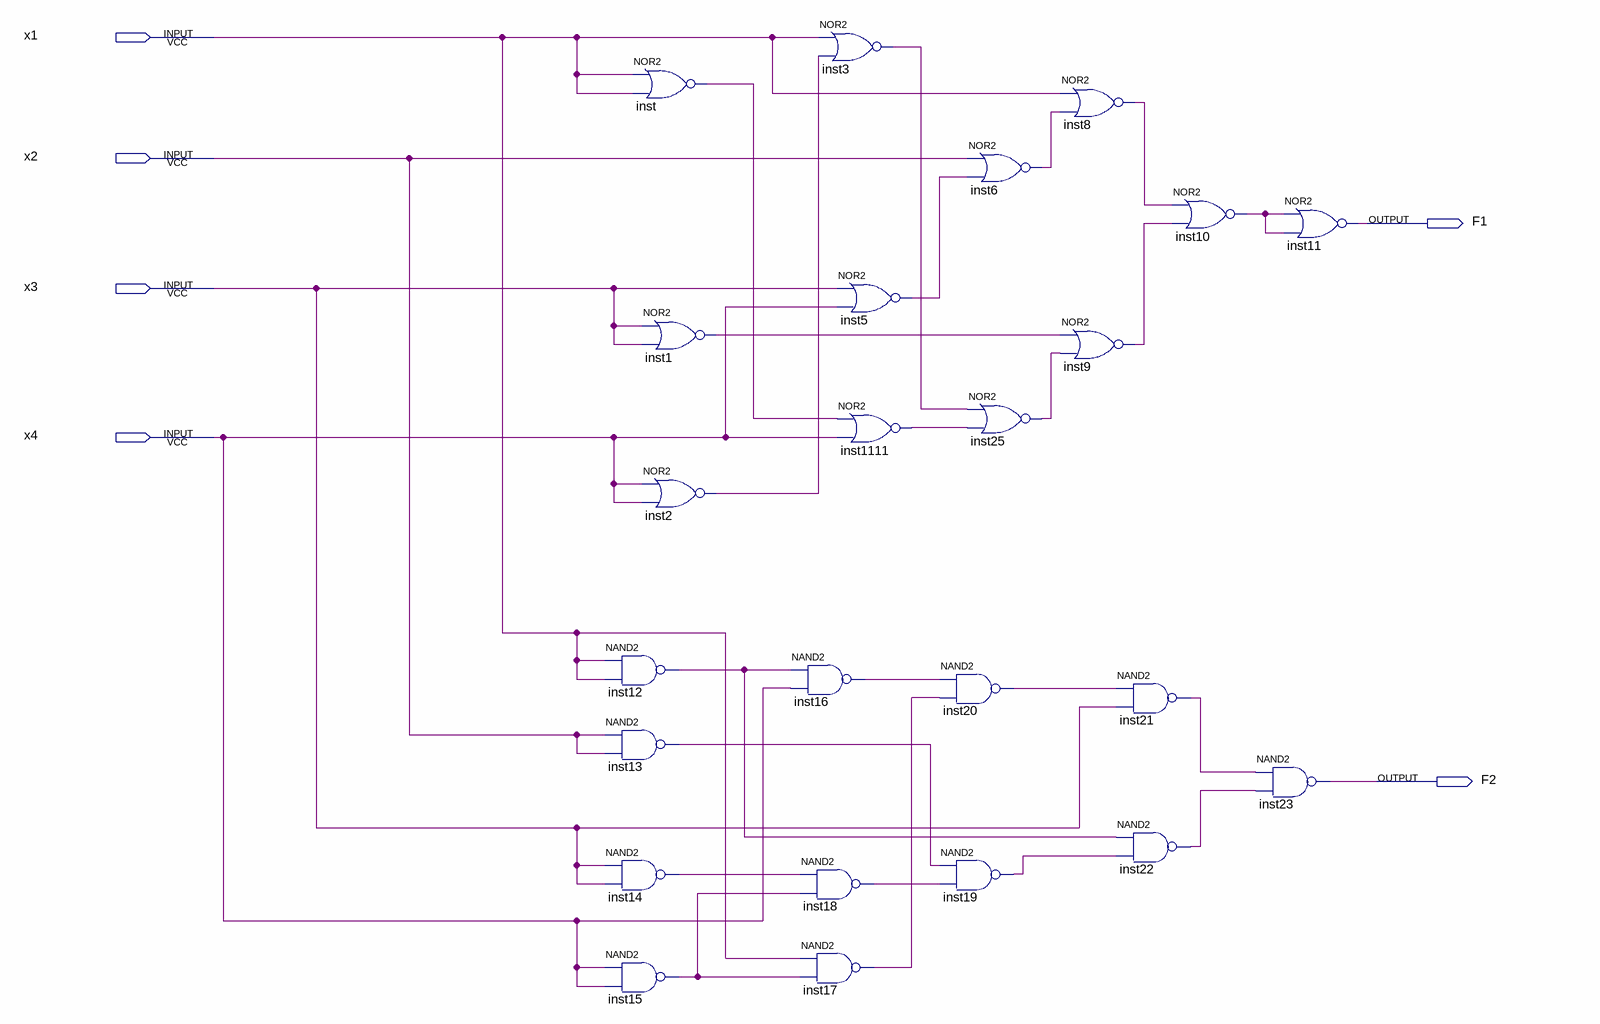
[diagram p0: schematic sheet]
// Quartus schematic lab1.bdf as structural Verilog: 24 symbols, 6 pins
module lab1 (
  input  x1,
  input  x2,
  input  x3,
  input  x4,
  output F1,
  output F2
);

  wire inst1_out, inst2_out, inst3_out, inst5_out, inst6_out, inst8_out, inst9_out, inst10_out, inst12_out,
       inst13_out, inst14_out, inst15_out, inst16_out, inst17_out, inst18_out, inst19_out, inst20_out,
       inst21_out, inst22_out, inst25_out, inst1111_out, inst_out;

  nor inst (inst_out, x1, x1);
  nor inst1 (inst1_out, x3, x3);
  nor inst2 (inst2_out, x4, x4);
  nand inst12 (inst12_out, x1, x1);
  nand inst13 (inst13_out, x2, x2);
  nand inst14 (inst14_out, x3, x3);
  nand inst15 (inst15_out, x4, x4);
  nand inst16 (inst16_out, inst12_out, x4);
  nand inst18 (inst18_out, inst14_out, inst15_out);
  nand inst17 (inst17_out, x1, inst15_out);
  nor inst3 (inst3_out, x1, inst2_out);
  nor inst5 (inst5_out, x3, x4);
  nor inst1111 (inst1111_out, inst_out, x4);
  nand inst20 (inst20_out, inst16_out, inst17_out);
  nand inst19 (inst19_out, inst13_out, inst18_out);
  nor inst6 (inst6_out, x2, inst5_out);
  nor inst25 (inst25_out, inst3_out, inst1111_out);
  nor inst8 (inst8_out, x1, inst6_out);
  nor inst9 (inst9_out, inst1_out, inst25_out);
  nor inst10 (inst10_out, inst8_out, inst9_out);
  nand inst21 (inst21_out, inst20_out, x3);
  nand inst22 (inst22_out, inst12_out, inst19_out);
  nor inst11 (F1, inst10_out, inst10_out);
  nand inst23 (F2, inst21_out, inst22_out);
endmodule
